# EAGLE schematic rgbw-pwm (EAGLE 6.3)
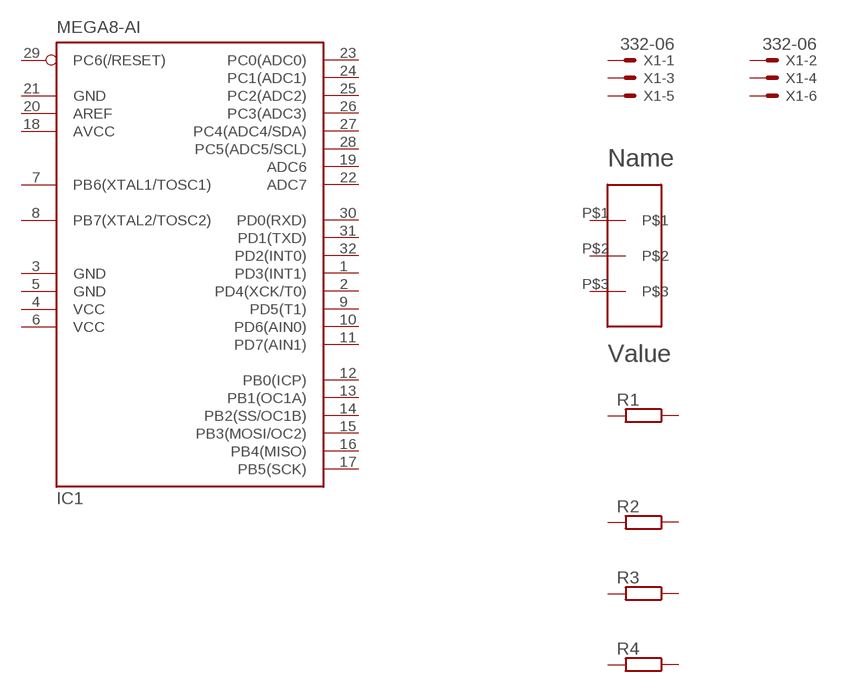
[diagram p0: schematic, sheet 1]

## Parts
IC1  MEGA8-AI  [TQFP32-08]
R1  SMK  [SMK]
R2  SMK  [SMK]
R3  SMK  [SMK]
R4  SMK  [SMK]
U$1  20020110-C031A01LFCOLOR:  [20020110-C031A01LF]
X1  332-06  [332-06]
Unconnected: IC1.1(PD3(INT1)) IC1.2(PD4(XCK/T0)) IC1.7(PB6(XTAL1/TOSC1)) IC1.8(PB7(XTAL2/TOSC2)) IC1.9(PD5(T1)) IC1.10(PD6(AIN0)) IC1.11(PD7(AIN1)) IC1.12(PB0(ICP)) IC1.13(PB1(OC1A)) IC1.14(PB2(SS/OC1B)) IC1.15(PB3(MOSI/OC2)) IC1.16(PB4(MISO)) IC1.17(PB5(SCK)) IC1.19(ADC6) IC1.20(AREF) IC1.22(ADC7) IC1.23(PC0(ADC0)) IC1.24(PC1(ADC1)) IC1.25(PC2(ADC2)) IC1.26(PC3(ADC3)) IC1.27(PC4(ADC4/SDA)) IC1.28(PC5(ADC5/SCL)) IC1.29(PC6(/RESET)) IC1.30(PD0(RXD)) IC1.31(PD1(TXD)) IC1.32(PD2(INT0)) R1.1 R1.2 R2.1 R2.2 R3.1 R3.2 R4.1 R4.2 U$1.P$1 U$1.P$2 U$1.P$3 X1.1 X1.2 X1.3 X1.4 X1.5 X1.6

## Power pins joined to a net without a drawn wire
AVCC: IC1.18(AVCC)
GND: IC1.3(GND) IC1.5(GND) IC1.21(GND)
VCC: IC1.4(VCC) IC1.6(VCC)

## Library data of the parts
IC1 = atmel:MEGA8: MICROCONTROLLER 8 Kbytes FLASH, 1 kbytes SRAM, 512 bytes EEPROM, USART, 6-channel 10 bit ADC, 2-channel 8 bit ADC Pin compatible with Atmega48, ATMega88, ATMega168 Source: avr.lbr; MPN: ATMEGA8-16AU; OC_FARNELL: 9171371; OC_NEWARK: 73M8863
R1-R4 = resistor-shunt:SMK: SMD SHUNT RESISTOR; OC_FARNELL: unknown; OC_NEWARK: unknown
U$1 = FCI_tkr_neu:20020110-C031A01LF: FCI Pluggable Socket - right angle - Signal Pitch 3.50mm Robust and solid design Modular system, 2 up to 24 pos. Right angle socket Signal Latching feature, no mis-match End-to-end stackable R recognized; DURABILITY: 200
X1 = con-garry:332-06: 6 Pin - 2mm Dual Row Source: www.mpe-connector.de / garry_shortform_2012.pdf